# EAGLE schematic ProgrammerConverterNonShrouded (EAGLE 6.4)
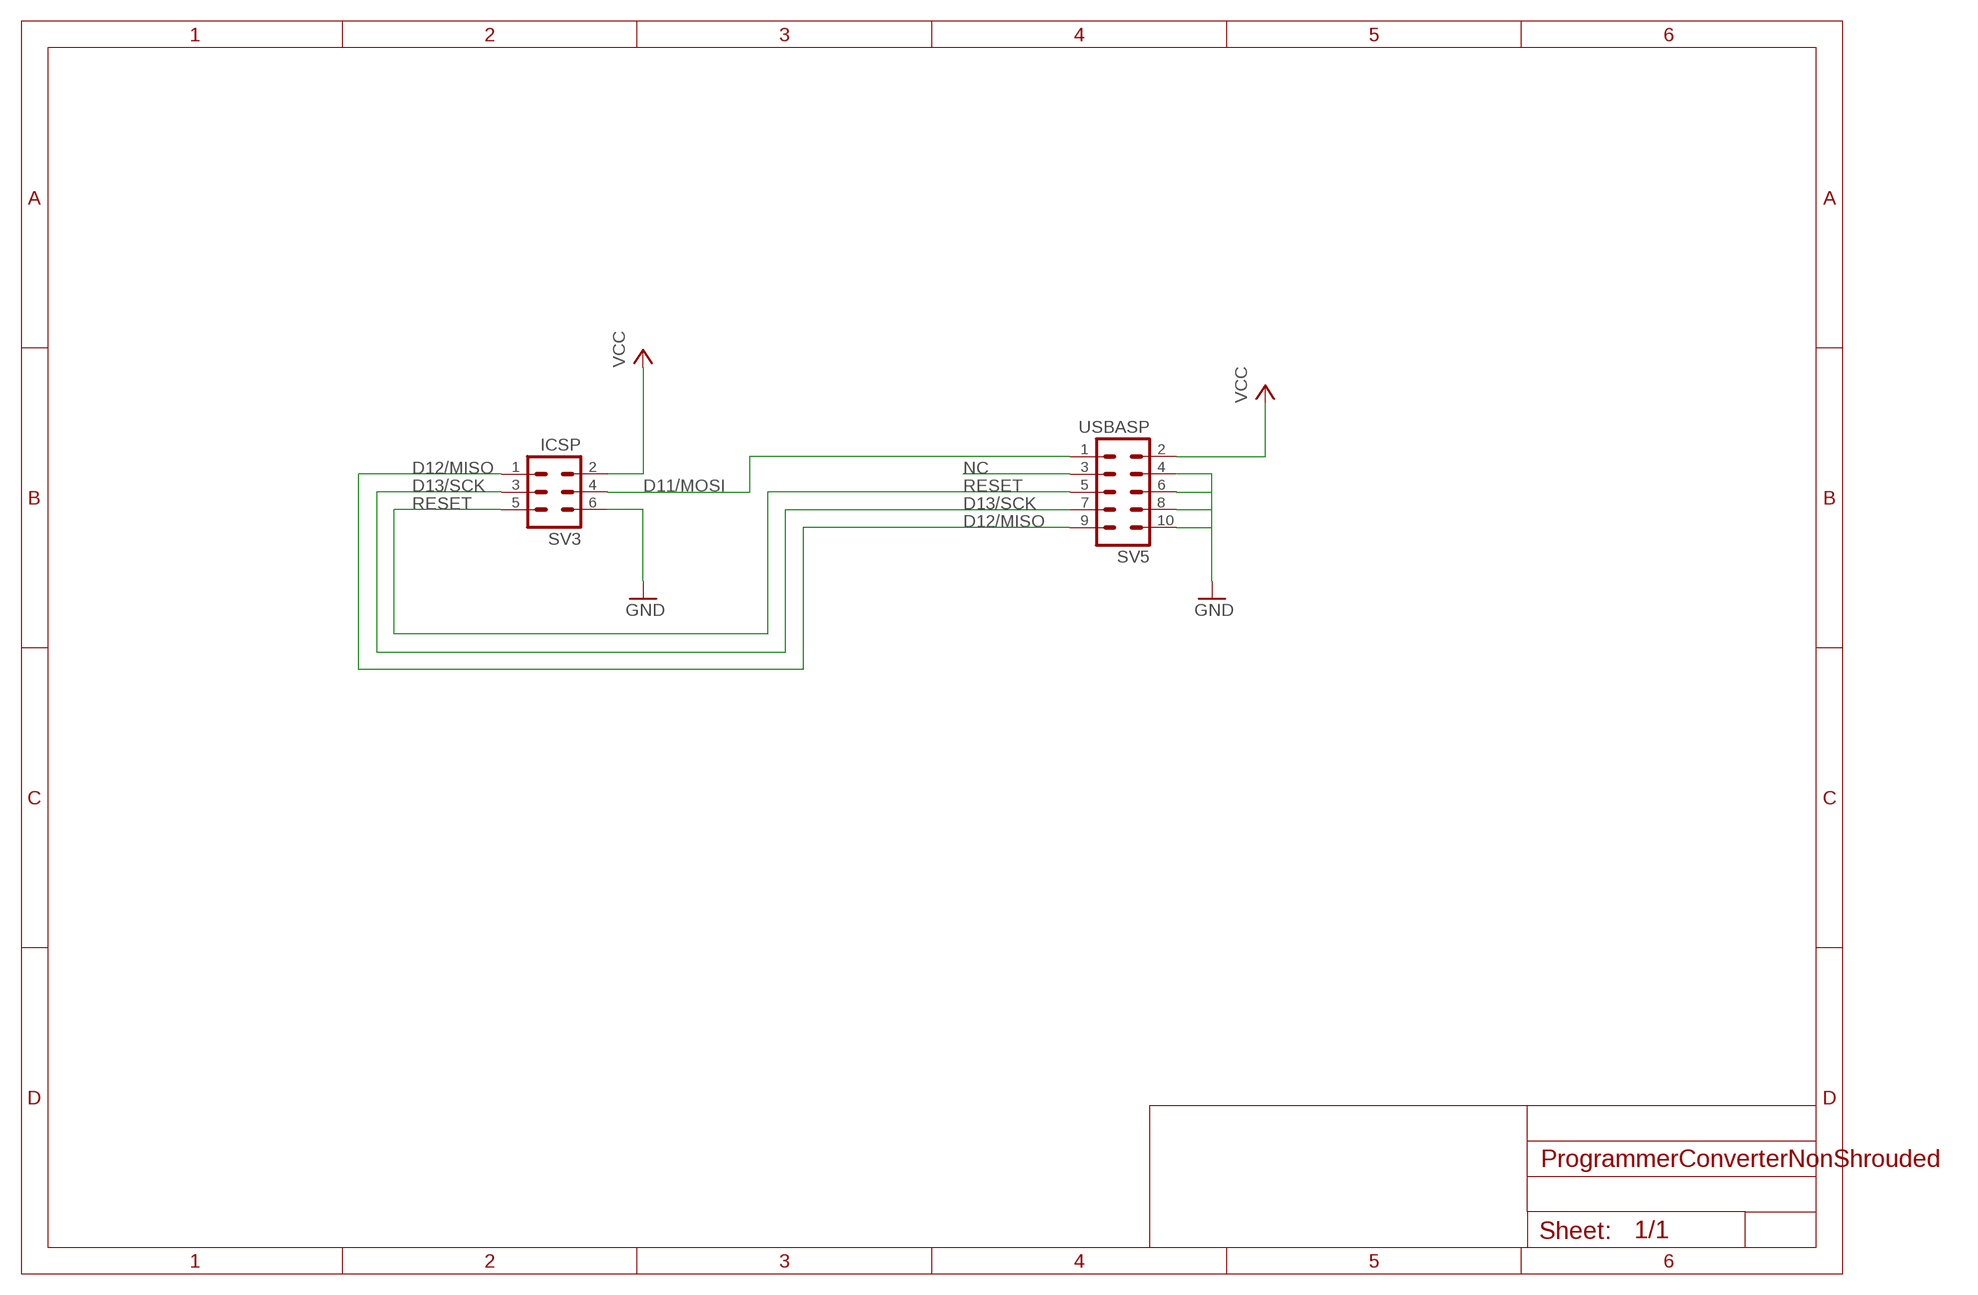
[diagram p0: schematic, sheet 1]

## Parts
SV3  ICSP  MA03-2  [MA03-2]
SV5  USBASP  MA05-2  [MA05-2]

## Nets
D11/MOSI: SV3.4 SV5.1
D12/MISO: SV3.1 SV5.9
D13/SCK: SV3.3 SV5.7
GND: SV3.6 SV5.4 SV5.6 SV5.8 SV5.10
NC: SV5.3
RESET: SV3.5 SV5.5
VCC: SV3.2 SV5.2

## Library data of the parts
SV3 = con-lstb:MA03-2: PIN HEADER; OC_FARNELL: unknown; OC_NEWARK: unknown
SV5 = con-lstb:MA05-2: PIN HEADER; OC_FARNELL: unknown; OC_NEWARK: unknown